# EAGLE design LConnector (EAGLE 6.5.0)
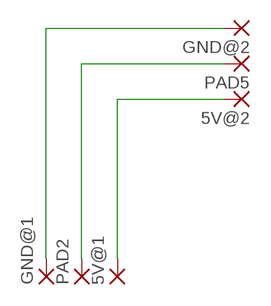
[diagram p0: schematic, sheet 1]

## Parts
5V@1  SMD2  [SMD1,27-2,54]
5V@2  SMD2  [SMD1,27-2,54]
GND@1  SMD2  [SMD1,27-2,54]
GND@2  SMD2  [SMD1,27-2,54]
PAD2  SMD2  [SMD1,27-2,54]
PAD5  SMD2  [SMD1,27-2,54]

## Nets
N$1: GND@1.1(P) GND@2.1(P)
N$2: PAD2.1(P) PAD5.1(P)
N$3: 5V@1.1(P) 5V@2.1(P)

## Library data of the parts
5V@1 5V@2 GND@1 GND@2 PAD2 PAD5 = wirepad:SMD2: SMD PAD

## Net classes
0 default: clearance 0.205 mm

## Board
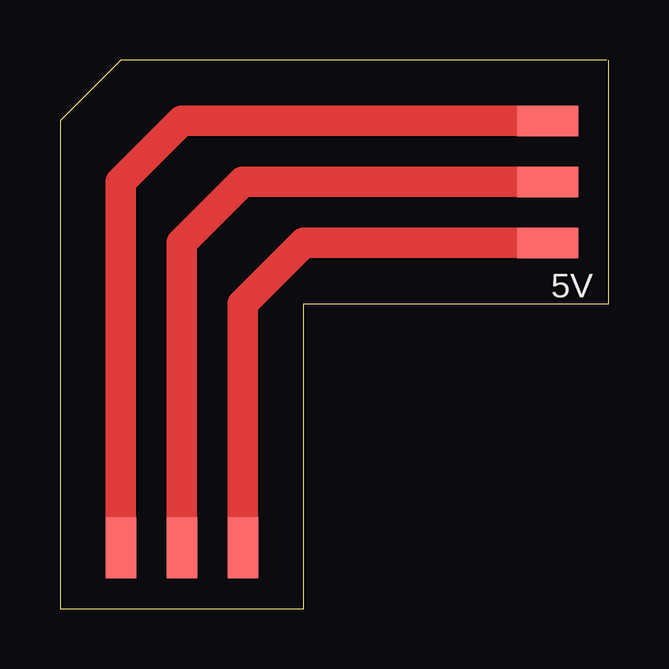
[diagram p1: board, top side]

Size 22.86 x 22.86 mm. Coordinates in mm from the lower left corner, seen from the top.
Outline: 22.86,22.86 22.86,12.7 10.16,12.7 10.16,0 0,0 0,20.32 2.54,22.86 22.78,22.85
Copper layers (1*16): Top 0.035mm / dielectric 1.5mm / Bottom 0.035mm
Design rules "default": minimum track width 10mil, minimum drill 24mil, track to track 8mil, track to pad 8mil, pad to pad 8mil, via to via 8mil, smd to smd 8mil, copper to edge 40mil, drill to drill 8mil, minimum pad ring 10mil, minimum via ring 8mil, stop-mask expansion 4mil, vias tented up to drill 0mil, thermal gap 10mil

### Footprints (pad centres in the part's own frame; a part is rotated, then mirrored left to right if it is on the bottom)
SMD1,27-2,54 = smd 1.27 x 2.54: 1 0,0

### Placement (x,y rotation side)
5V@1  7.62,2.54 0 top
5V@2  20.32,15.24 90 top
GND@1  2.54,2.54 0 top
GND@2  20.32,20.32 90 top
PAD2  5.08,2.54 0 top
PAD5  20.32,17.78 90 top

### Tracks (layer width: path | path; a pad name or v marks a point on that pad's centre or on a via)
N$1
  Top 1.27: GND@1.1 2.54,17.78 5.08,20.32 GND@2.1
N$2
  Top 1.27: PAD2.1 5.08,15.24 7.62,17.78 PAD5.1
N$3
  Top 1.27: 5V@1.1 7.62,12.7 10.16,15.24 5V@2.1

### Text on the board
tNames: 5V
bNames: 5V